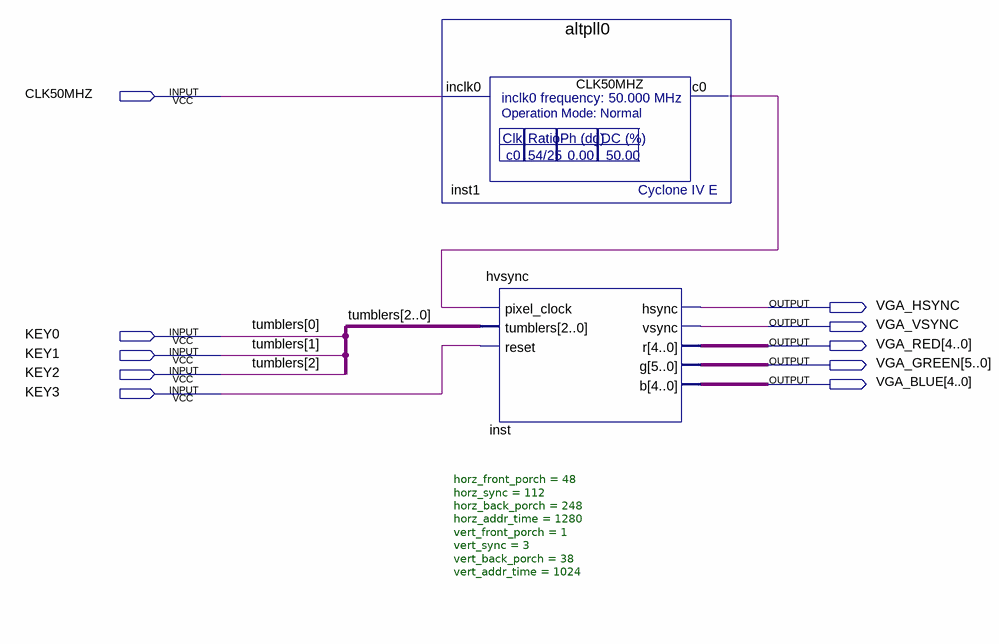
[diagram p0: schematic sheet]
// Quartus schematic cyclone4.bdf as structural Verilog: 2 symbols, 10 pins
module cyclone4 (
  input  CLK50MHZ,
  input  KEY0,
  input  KEY1,
  input  KEY2,
  input  KEY3,
  output VGA_HSYNC,
  output VGA_VSYNC,
  output [4:0] VGA_RED,
  output [5:0] VGA_GREEN,
  output [4:0] VGA_BLUE
);

  wire inst1_c0;

  altpll0 inst1 (.inclk0(CLK50MHZ), .c0(inst1_c0));
  hvsync #(.horz_front_porch(48), .horz_sync(112), .horz_back_porch(248), .horz_addr_time(1280), .vert_front_porch(1), .vert_sync(3), .vert_back_porch(38), .vert_addr_time(1024)) inst (
    .pixel_clock(inst1_c0), .tumblers({KEY2, KEY1, KEY0}), .reset(KEY3), .hsync(VGA_HSYNC),
    .vsync(VGA_VSYNC), .r(VGA_RED), .g(VGA_GREEN), .b(VGA_BLUE));

  // Other names for the same wires on the sheet: tumblers[2:0] = {KEY2, KEY1, KEY0}
endmodule
